# Altium schematic sheet Block Diagram and Notes.SchDoc
size B
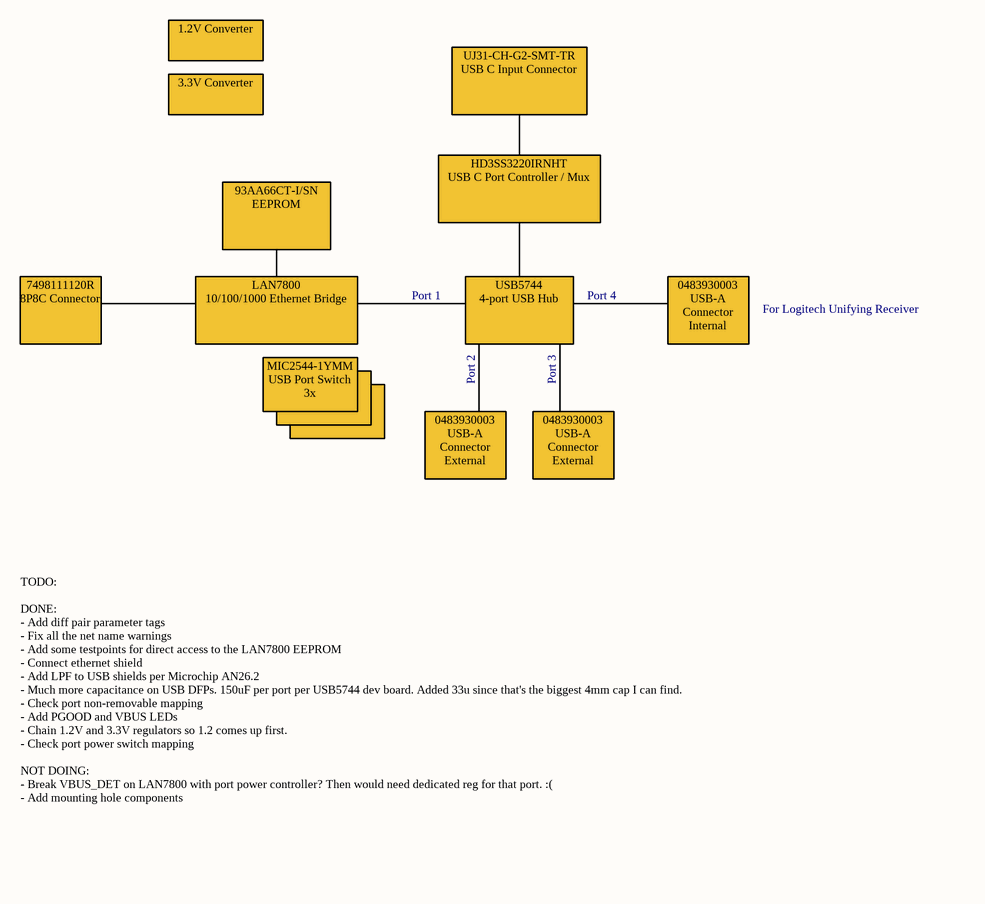
[diagram p0: Block Diagram and Notes.SchDoc]

## Notes on the sheet
- 1.2V Converter
- 3.3V Converter
- UJ31-CH-G2-SMT-TR
  USB C Input Connector
- 93AA66CT-I/SN
  EEPROM
- HD3SS3220IRNHT
  USB C Port Controller / Mux
- Port 1
- Port 4
- For Logitech Unifying Receiver
- 7498111120R
  8P8C Connector
- LAN7800
  10/100/1000 Ethernet Bridge
- USB5744
  4-port USB Hub
- Port 2
- Port 3
- 0483930003
  USB-A Connector
  Internal
- MIC2544-1YMM
  USB Port Switch
  3x
- 0483930003
  USB-A Connector
  External
- TODO:
  DONE:
  - Add diff pair parameter tags
  - Fix all the net name warnings
  - Add some testpoints for direct access to the LAN7800 EEPROM
  - Connect ethernet shield
  - Add LPF to USB shields per Microchip AN26.2
  - Much more capacitance on USB DFPs. 150uF per port per USB5744 dev board. Added 33u since that's the biggest 4mm cap I can find.
  - Check port non-removable mapping
  - Add PGOOD and VBUS LEDs
  - Chain 1.2V and 3.3V regulators so 1.2 comes up first.
  - Check port power switch mapping
  NOT DOING:
  - Break VBUS_DET on LAN7800 with port power controller? Then would need dedicated reg for that port. :(
  - Add mounting hole components